# Altium schematic sheet KF7.62-2P1_KF7.62-2P.schdoc
size 124 x 99 mm
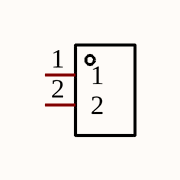
[diagram p0: KF7.62-2P1_KF7.62-2P.schdoc]

## Parts
U?  KF7.62-2P  [CONN-TH_KF7.62-2P]  (value not drawn)

## Nets

Not connected (* = marked no-connect by the designer): U? 1 2

## Library data of the parts
U? = KF7.62-2P: Manufacturer: KEFA(科发); Add into BOM: yes; Barrier Type: 两面; Pitch: 7.62mm; Structure: 1x2P; Pin Location: 边脚; Current Rating (Max): 24A; Voltage Rating (Max): 450V; Wire Gauge - AWG: 12~22; Wire Gauge - mm2: 2.5; Number of PINs Per Row: 2; Symbol: KF7.62-2P; Device: KF7.62-2P; LCSC Part Name: 7.62mm 1x2P 每排P数:2 排数:1 直针 边脚 黑色; Supplier Part: C707824; Manufacturer Part: KF7.62-2P; Supplier Footprint: 插件,P=7.62mm; JLCPCB Part Class: Extended Part; Datasheet: https://atta.szlcsc.com/upload/public/pdf/source/20230331/11104CA872B730518BFDFC9F574D6E42.pdf; Supplier: LCSC; Convert to PCB: yes; Mounting Style: 直针; Number of Pins: 2P; Number of Rows: 1; Operating Temperature Range: -40℃~+105℃; Color: 黑色